# Altium schematic sheet PCB_DYBoard_Collector_V1_Sh3.SchDoc
size A4; SheetNumber: 3; SheetTotal: 3
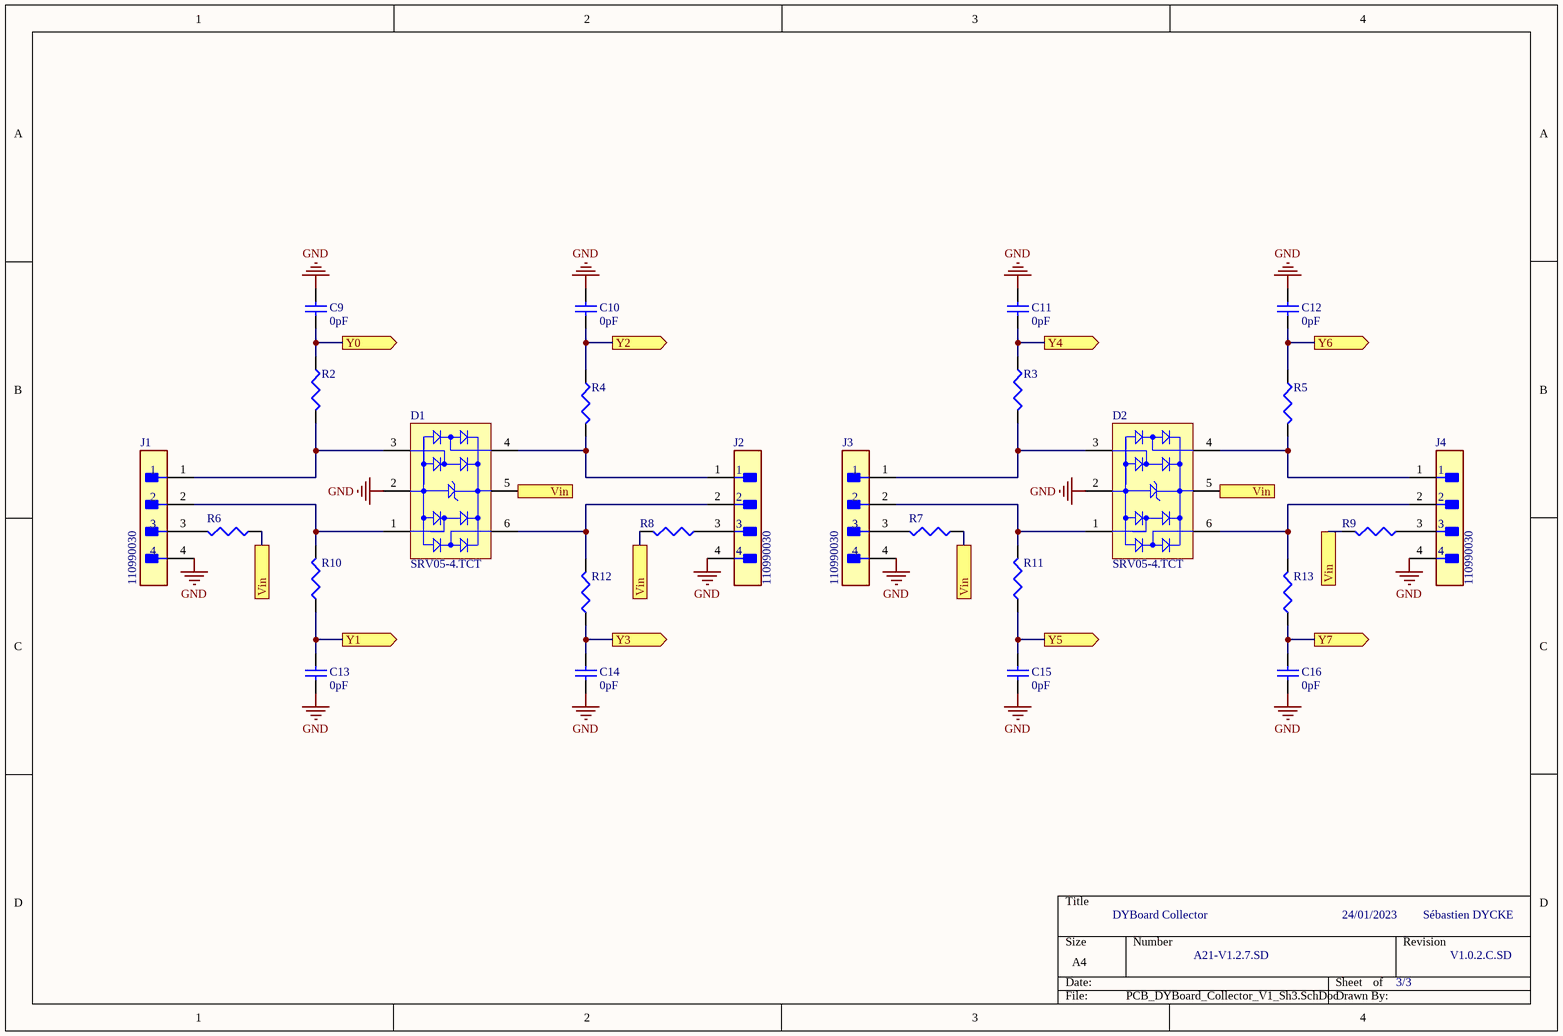
[diagram p0: PCB_DYBoard_Collector_V1_Sh3.SchDoc]

## Parts
C9  value 0pF  [1608[0603]]  (hidden comment: Cap Semi)
C10  value 0pF  [1608[0603]]  (hidden comment: Cap Semi)
C11  value 0pF  [1608[0603]]  (hidden comment: Cap Semi)
C12  value 0pF  [1608[0603]]  (hidden comment: Cap Semi)
C13  value 0pF  [1608[0603]]  (hidden comment: Cap Semi)
C14  value 0pF  [1608[0603]]  (hidden comment: Cap Semi)
C15  value 0pF  [1608[0603]]  (hidden comment: Cap Semi)
C16  value 0pF  [1608[0603]]  (hidden comment: Cap Semi)
D1  SRV05-4.TCT  [SMTC-SOT23-6_V]
D2  SRV05-4.TCT  [SMTC-SOT23-6_V]
J1  110990030  [FP-110990030-MFG]
J2  110990030  [FP-110990030-MFG]
J3  110990030  [FP-110990030-MFG]
J4  110990030  [FP-110990030-MFG]
R2  Res3  [J1-0603]  (value not drawn)
R3  Res3  [J1-0603]  (value not drawn)
R4  Res3  [J1-0603]  (value not drawn)
R5  Res3  [J1-0603]  (value not drawn)
R6  Res3  [J1-0603]  (value not drawn)
R7  Res3  [J1-0603]  (value not drawn)
R8  Res3  [J1-0603]  (value not drawn)
R9  Res3  [J1-0603]  (value not drawn)
R10  Res3  [J1-0603]  (value not drawn)
R11  Res3  [J1-0603]  (value not drawn)
R12  Res3  [J1-0603]  (value not drawn)
R13  Res3  [J1-0603]  (value not drawn)

## Ports
Vin (see PCB_DYBoard_Collector_V1_Sh2[3A], PCB_DYBoard_Collector_V1_Sh2[1B], PCB_DYBoard_Collector_V1_Sh2[1C], PCB_DYBoard_Collector_V1_Sh2[1D], PCB_DYBoard_Collector_V1_Sh2[2A], PCB_DYBoard_Collector_V1_Sh2[2B], PCB_DYBoard_Collector_V1_Sh2[2C], PCB_DYBoard_Collector_V1_Sh2[2D], PCB_DYBoard_Collector_V1_Sh2[3A], PCB_DYBoard_Collector_V1_Sh2[3B], PCB_DYBoard_Collector_V1_Sh2[3C], PCB_DYBoard_Collector_V1_Sh2[3D]), Y0 (out, see PCB_DYBoard_Collector_V1_Sh2[3A]), Y1 (out, see PCB_DYBoard_Collector_V1_Sh2[3A]), Y2 (out, see PCB_DYBoard_Collector_V1_Sh2[3B]), Y3 (out, see PCB_DYBoard_Collector_V1_Sh2[3B]), Y4 (out, see PCB_DYBoard_Collector_V1_Sh2[3B]), Y5 (out, see PCB_DYBoard_Collector_V1_Sh2[3B]), Y6 (out, see PCB_DYBoard_Collector_V1_Sh2[3B]), Y7 (out, see PCB_DYBoard_Collector_V1_Sh2[3B])

## Nets
GND: C9.2 C10.2 C11.2 C12.2 C13.1 C14.1 C15.1 C16.1 D1.2(GND) D2.2(GND) J1.4 J2.4 J3.4 J4.4
Vin: D1.5(VBUS) D2.5(VBUS) R6.2 R7.2 R8.2 R9.2 ; port Vin
Y0: C9.1 R2.1 ; port Y0
Y1: C13.2 R10.1 ; port Y1
Y2: C10.1 R4.1 ; port Y2
Y3: C14.2 R12.1 ; port Y3
Y4: C11.1 R3.1 ; port Y4
Y5: C15.2 R11.1 ; port Y5
Y6: C12.1 R5.1 ; port Y6
Y7: C16.2 R13.1 ; port Y7
NetD1_1: D1.1(I/O_1) J1.2 R10.2
NetD1_3: D1.3(I/O_2) J1.1 R2.2
NetD1_4: D1.4(I/O_3) J2.1 R4.2
NetD1_6: D1.6(I/O_4) J2.2 R12.2
NetD2_1: D2.1(I/O_1) J3.2 R11.2
NetD2_3: D2.3(I/O_2) J3.1 R3.2
NetD2_4: D2.4(I/O_3) J4.1 R5.2
NetD2_6: D2.6(I/O_4) J4.2 R13.2
NetJ1_3: J1.3 R6.1
NetJ2_3: J2.3 R8.1
NetJ3_3: J3.3 R7.1
NetJ4_3: J4.3 R9.1

## Notes on the sheet
- DYBoard Collector
- 24/01/2023
- Sébastien DYCKE
- A21-V1.2.7.SD
- 3/3
- V1.0.2.C.SD

## Library data of the parts
C9-C16 = Cap Semi: Capacitor (Semiconductor SIM Model); Published: 8-Jun-2000; LatestRevisionDate: 29-May-2009; LatestRevisionNote: IPC-7351 Footprint Added.; PackageReference: C1206; Publisher: Altium Limited; PackageDescription: Chip Capacitor
D1 D2 = CMP-2000-05358-1: RailClamp(R) Low Capacitance TVS Diode Array, 5 pF, 17.5 VC, -55 to 125 degC, 6-Pin SOT23, RoHS, Tape and Reel; Manufacturer: Semtech; Leakage Current (Max): 5uA; Polarity: Uni-Directional; Peak Pulse Power Dissipation: 300W; Clamping Voltage: 17.5V; Number of Elements: 1; Working Voltage: 5V; Test Current (It): 1mA; Configuration: Quad; Reverse Breakdown Voltage: 6V; Suppressor Type: DiodeArrays; Peak Pulse Current: 12A; Product Depth (mm): 1.6mm; Product Height (mm): 1.15mm; Clamping Voltage (Max): 12.5V; Rad Hardened: No; Product Length (mm): 2.9mm; Capacitance Value: 5pF; Mounting: SurfaceMount; Datasheet URL: https://datasheet.ciiva.com/8029/srv05-4-8029973.pdf; Datasheet Version: Jan-08; Packaging: TapeandReel; Package / Case: SOT-23; Operating Temp Range: -55Cto125C; Pin Count: 6; Direction Type: Uni-Directional; Operating Temperature Min Deg. C: -55C; Reverse Stand-off Voltage: 5V; Leakage Current: 5uA; Manufacturer URL: http://www.semtech.com/; Working Voltage (Max): 5V; Package Reference: SOT23-6; Package Description: 6-Pin Small Outline Transistor, Body 2.9 x 1.6 mm, Pitch 0.95 mm; Operating Temperature Max Deg. C: 125C; Operating Temperature Classification: Military; Mounting Style: SurfaceMount
J1-J4 = CMP-139044-000001-1: GROVE 2MM 4PIN VERT CONN 10PCS; Series: -
R2-R13 = Res3: Resistor; Published: 8-Jun-2000; LatestRevisionDate: 29-May-2009; LatestRevisionNote: IPC-7351 Footprint Added.; PackageReference: J1-0603; Publisher: Altium Limited; PackageDescription: Chip Resistor